# Altium schematic sheet BUMPER SCHEMA.SchDoc
size A4
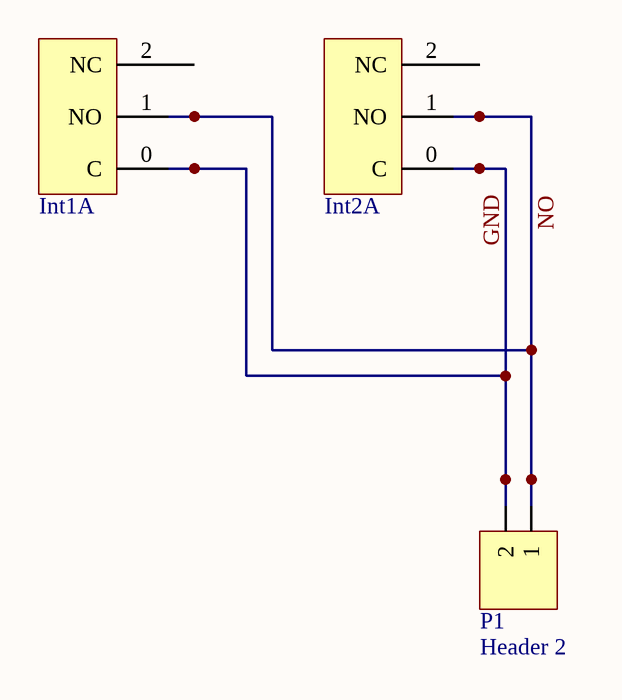
[diagram p0: BUMPER SCHEMA.SchDoc]

## Parts
Int1  DB2C-A1RC  [PCBComponent_1]  (value not drawn)  (part A of 3)
Int2  DB2C-A1RC  [PCBComponent_1]  (value not drawn)  (part A of 3)
P1  Header 2  [HDR1X2]

## Nets
GND: Int1.0(C) Int2.0(C) P1.2
NO: Int1.1(NO) Int2.1(NO) P1.1

Not connected (* = marked no-connect by the designer): Int1 2(NC); Int2 2(NC)

## Library data of the parts
Int1 Int2 = DB2C-A1RC: Microrupteur à galet
P1 = Header 2: Header, 2-Pin; LatestRevisionDate: 17-Jul-2002; LatestRevisionNote: Re-released for DXP Platform.; Publisher: Altium Limited